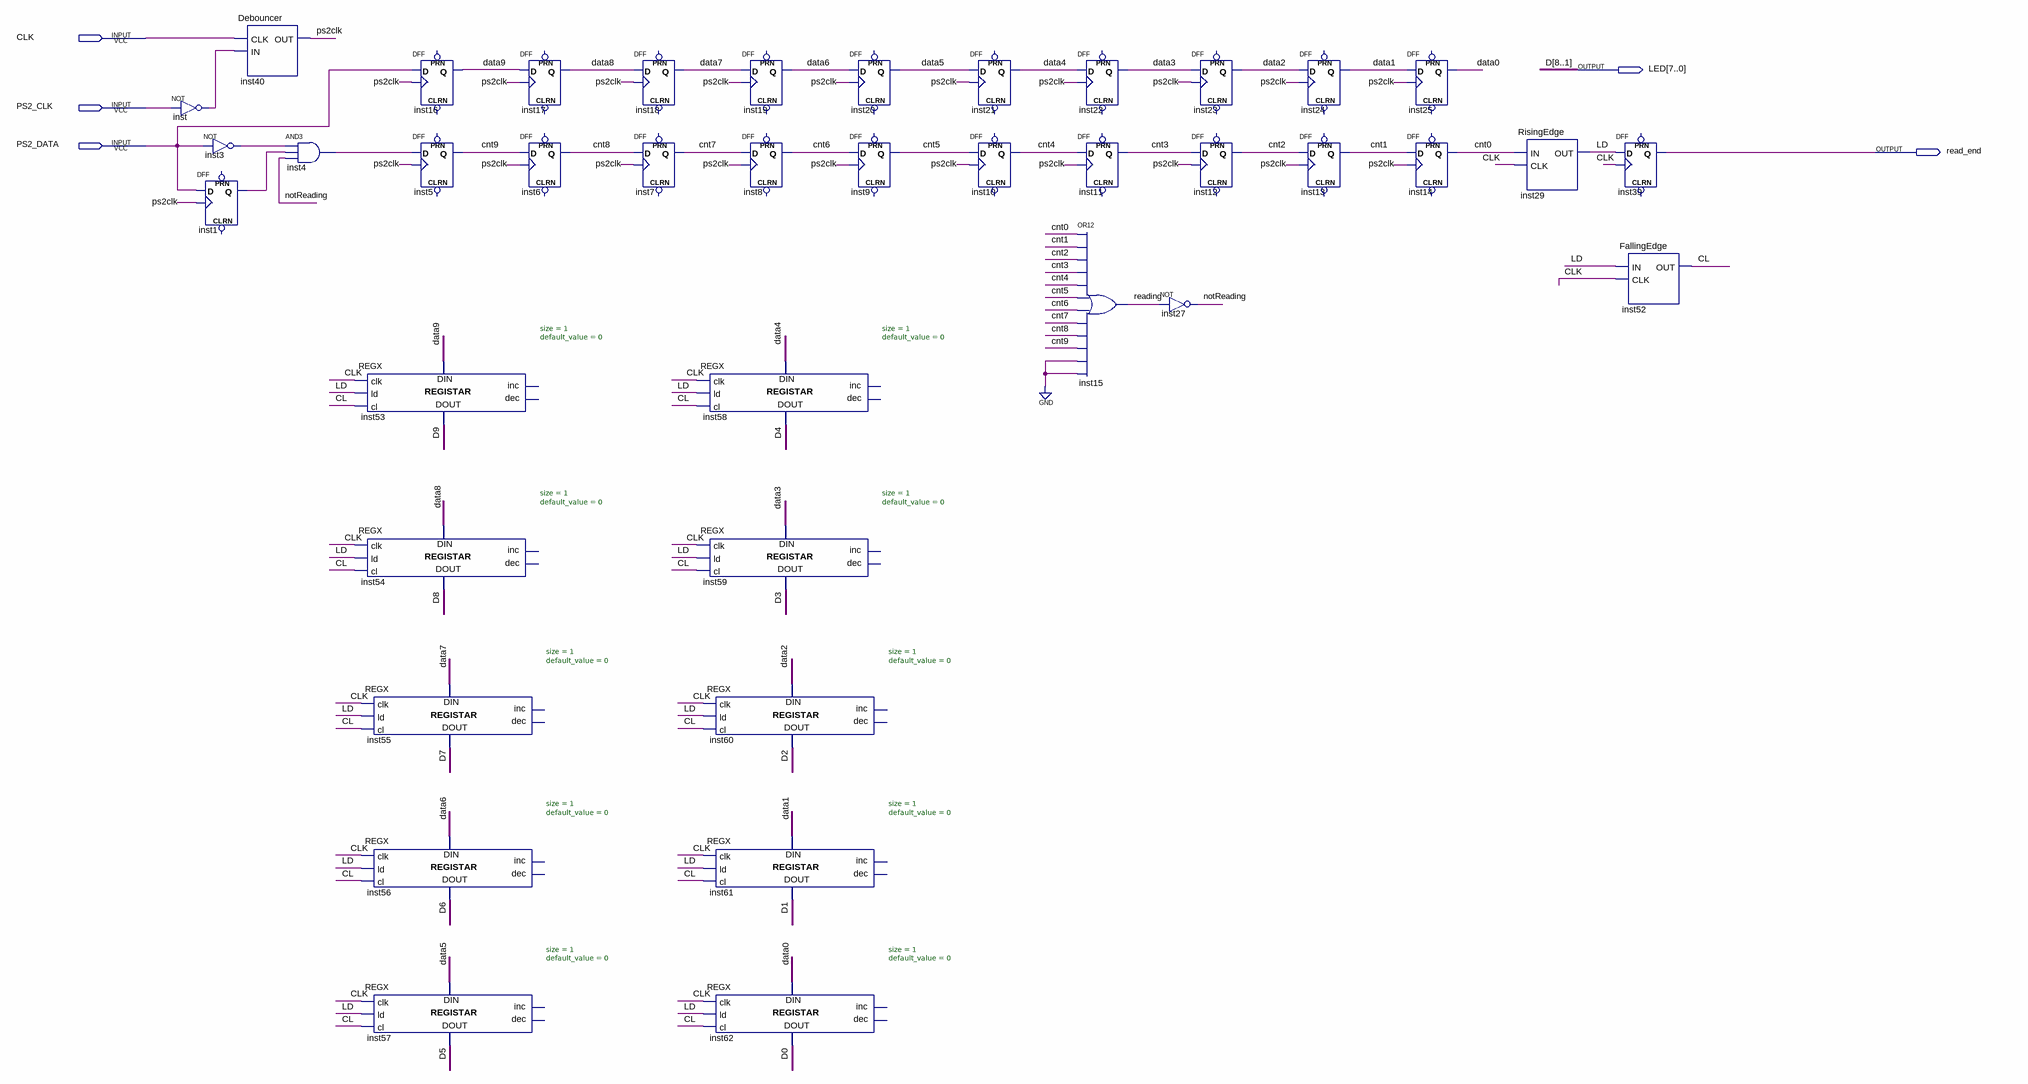
[diagram p0: schematic sheet]
// Quartus schematic Tastatura.bdf as structural Verilog: 40 symbols, 5 pins
module Tastatura (
  input  CLK,
  input  PS2_CLK,
  input  PS2_DATA,
  output [7:0] LED,
  output read_end
);

  wire CL, cnt0, cnt1, cnt2, cnt3, cnt4, cnt5, cnt6, cnt7, cnt8, cnt9, D0, D9, data0, data1, data2, data3,
       data4, data5, data6, data7, data8, data9, inst1_q, inst3_out, inst4_out, inst_out, LD, notReading,
       ps2clk, reading;

  not inst (inst_out, PS2_CLK);
  not inst3 (inst3_out, PS2_DATA);
  DFF inst1 (.CLK(ps2clk), .D(PS2_DATA), .Q(inst1_q));  // open: CLRN, PRN
  Debouncer inst40 (.CLK(CLK), .IN(inst_out), .OUT(ps2clk));
  and inst4 (inst4_out, inst3_out, inst1_q, notReading);
  REGX #(.size(1), .default_value(0)) inst53 (
    .clk(CLK), .ld(LD), .cl(CL), .data_in(data9), .data_out(D9));  // open: inc, dec
  REGX #(.size(1), .default_value(0)) inst54 (
    .clk(CLK), .ld(LD), .cl(CL), .data_in(data8), .data_out(LED[7]));  // open: inc, dec
  REGX #(.size(1), .default_value(0)) inst55 (
    .clk(CLK), .ld(LD), .cl(CL), .data_in(data7), .data_out(LED[6]));  // open: inc, dec
  REGX #(.size(1), .default_value(0)) inst56 (
    .clk(CLK), .ld(LD), .cl(CL), .data_in(data6), .data_out(LED[5]));  // open: inc, dec
  REGX #(.size(1), .default_value(0)) inst57 (
    .clk(CLK), .ld(LD), .cl(CL), .data_in(data5), .data_out(LED[4]));  // open: inc, dec
  DFF inst16 (.CLK(ps2clk), .D(PS2_DATA), .Q(data9));  // open: CLRN, PRN
  DFF inst5 (.CLK(ps2clk), .D(inst4_out), .Q(cnt9));  // open: CLRN, PRN
  DFF inst17 (.CLK(ps2clk), .D(data9), .Q(data8));  // open: CLRN, PRN
  DFF inst6 (.CLK(ps2clk), .D(cnt9), .Q(cnt8));  // open: CLRN, PRN
  DFF inst18 (.CLK(ps2clk), .D(data8), .Q(data7));  // open: CLRN, PRN
  DFF inst7 (.CLK(ps2clk), .D(cnt8), .Q(cnt7));  // open: CLRN, PRN
  REGX #(.size(1), .default_value(0)) inst58 (
    .clk(CLK), .ld(LD), .cl(CL), .data_in(data4), .data_out(LED[3]));  // open: inc, dec
  REGX #(.size(1), .default_value(0)) inst59 (
    .clk(CLK), .ld(LD), .cl(CL), .data_in(data3), .data_out(LED[2]));  // open: inc, dec
  REGX #(.size(1), .default_value(0)) inst60 (
    .clk(CLK), .ld(LD), .cl(CL), .data_in(data2), .data_out(LED[1]));  // open: inc, dec
  REGX #(.size(1), .default_value(0)) inst61 (
    .clk(CLK), .ld(LD), .cl(CL), .data_in(data1), .data_out(LED[0]));  // open: inc, dec
  REGX #(.size(1), .default_value(0)) inst62 (
    .clk(CLK), .ld(LD), .cl(CL), .data_in(data0), .data_out(D0));  // open: inc, dec
  DFF inst19 (.CLK(ps2clk), .D(data7), .Q(data6));  // open: CLRN, PRN
  DFF inst8 (.CLK(ps2clk), .D(cnt7), .Q(cnt6));  // open: CLRN, PRN
  DFF inst20 (.CLK(ps2clk), .D(data6), .Q(data5));  // open: CLRN, PRN
  DFF inst9 (.CLK(ps2clk), .D(cnt6), .Q(cnt5));  // open: CLRN, PRN
  DFF inst21 (.CLK(ps2clk), .D(data5), .Q(data4));  // open: CLRN, PRN
  DFF inst10 (.CLK(ps2clk), .D(cnt5), .Q(cnt4));  // open: CLRN, PRN
  DFF inst22 (.CLK(ps2clk), .D(data4), .Q(data3));  // open: CLRN, PRN
  DFF inst11 (.CLK(ps2clk), .D(cnt4), .Q(cnt3));  // open: CLRN, PRN
  or inst15 (reading, cnt0, cnt1, cnt2, cnt3, cnt4, cnt5, cnt6, cnt7, cnt8, cnt9, 1'b0, 1'b0);
  not inst27 (notReading, reading);
  DFF inst23 (.CLK(ps2clk), .D(data3), .Q(data2));  // open: CLRN, PRN
  DFF inst12 (.CLK(ps2clk), .D(cnt3), .Q(cnt2));  // open: CLRN, PRN
  DFF inst24 (.CLK(ps2clk), .D(data2), .Q(data1));  // open: CLRN, PRN
  DFF inst13 (.CLK(ps2clk), .D(cnt2), .Q(cnt1));  // open: CLRN, PRN
  DFF inst25 (.CLK(ps2clk), .D(data1), .Q(data0));  // open: CLRN, PRN
  DFF inst14 (.CLK(ps2clk), .D(cnt1), .Q(cnt0));  // open: CLRN, PRN
  RisingEdge inst29 (.IN(cnt0), .CLK(CLK), .OUT(LD));
  DFF inst39 (.CLK(CLK), .D(LD), .Q(read_end));  // open: CLRN, PRN
  FallingEdge inst52 (.IN(LD), .CLK(CLK), .OUT(CL));

  // Other names for the same wires on the sheet: D[8:1] = LED; D1 = LED[0]; D2 = LED[1]; D3 = LED[2]; D4 = LED[3];
  //   D5 = LED[4]; D6 = LED[5]; D7 = LED[6]; D8 = LED[7]
endmodule
